# EAGLE design ADS1299_power (EAGLE 8.3.1)
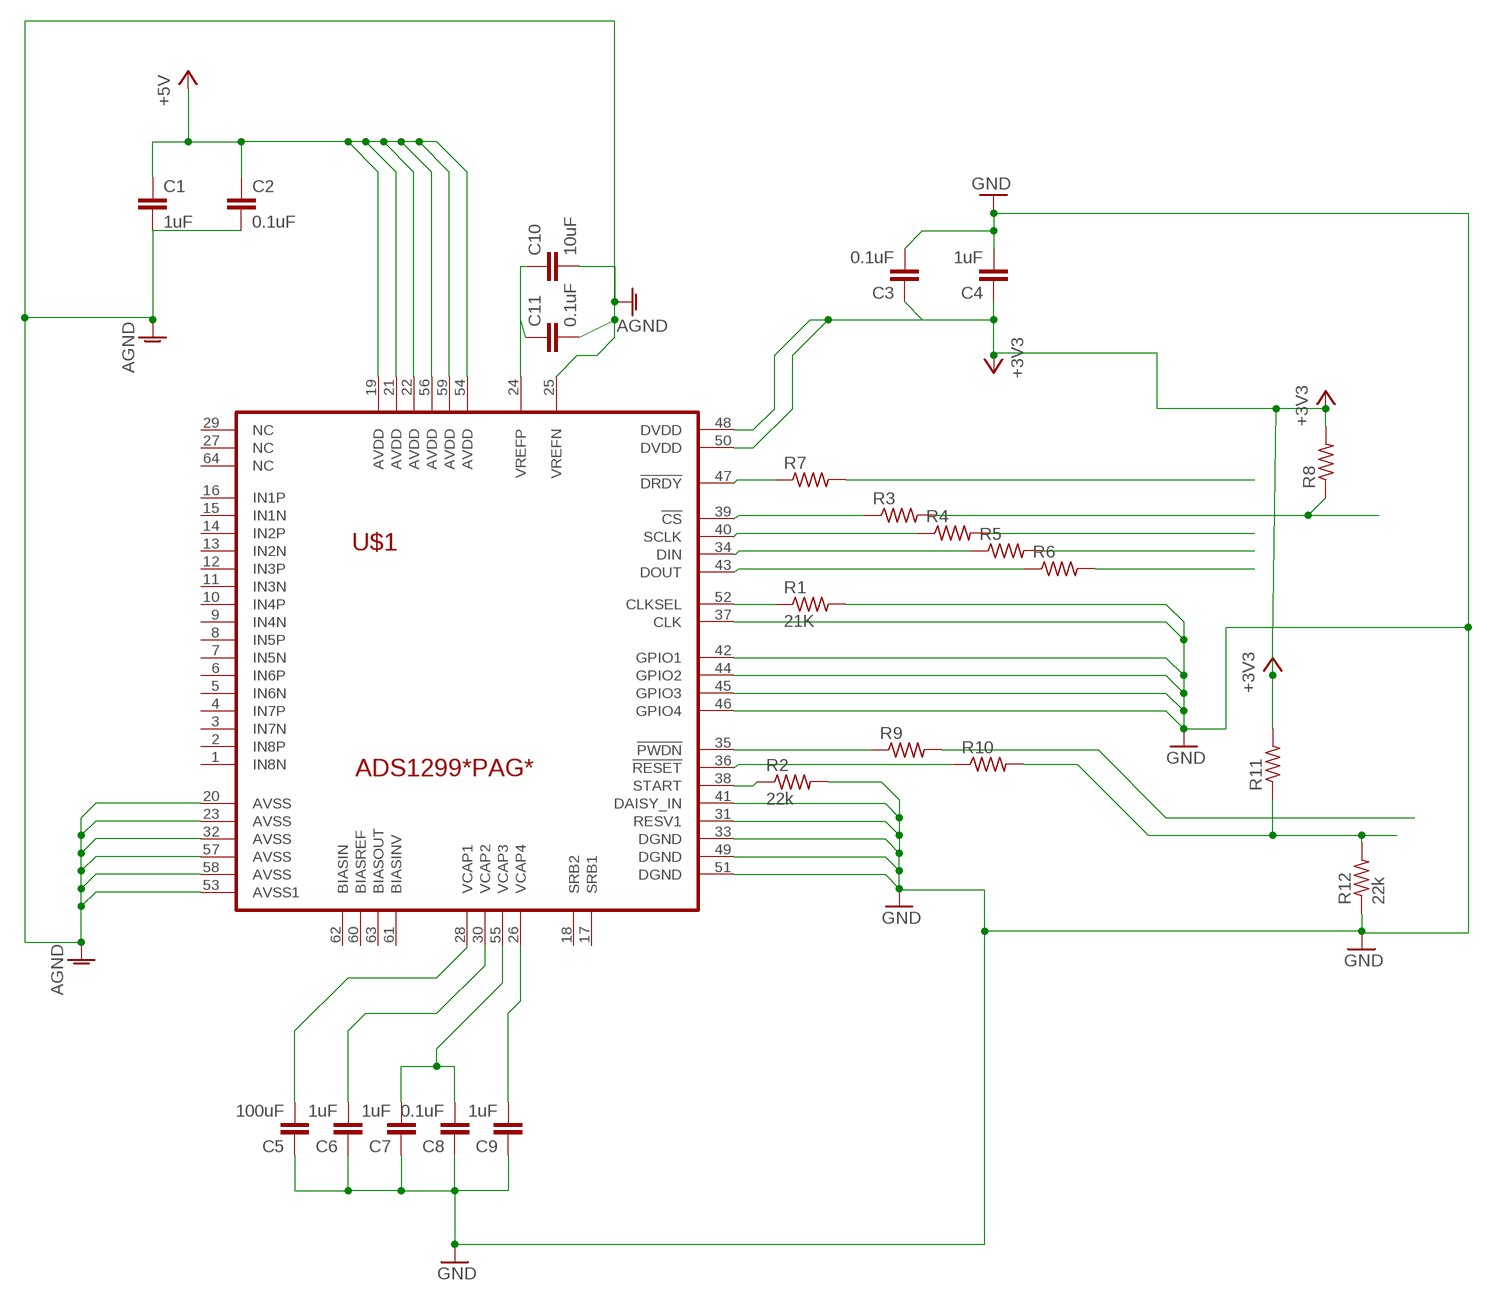
[diagram p0: schematic, sheet 1]

## Parts
C1  1uF  C2,5-3  [C2.5-3]
C2  0.1uF  C2,5-3  [C2.5-3]
C3  0.1uF  C2,5-3  [C2.5-3]
C4  1uF  C2,5-3  [C2.5-3]
C5  100uF  C2,5-3  [C2.5-3]
C6  1uF  C2,5-3  [C2.5-3]
C7  1uF  C2,5-3  [C2.5-3]
C8  0.1uF  C2,5-3  [C2.5-3]
C9  1uF  C2,5-3  [C2.5-3]
C10  10uF  C2,5-3  [C2.5-3]
C11  0.1uF  C2,5-3  [C2.5-3]
R1  21K  R-US_0204/2V  [0204V]
R2  22k  R-US_0204/2V  [0204V]
R3  R-US_0204/2V  [0204V]
R4  R-US_0204/2V  [0204V]
R5  R-US_0204/2V  [0204V]
R6  R-US_0204/2V  [0204V]
R7  R-US_0204/2V  [0204V]
R8  R-US_0204/2V  [0204V]
R9  R-US_0204/2V  [0204V]
R10  R-US_0204/2V  [0204V]
R11  R-US_0204/2V  [0204V]
R12  22k  R-US_0204/2V  [0204V]
U$1  ADS1299*PAG*  [TQFP64]

## Nets
+3V3: C3.1 C4.1 R8.2 R11.2 U$1.48(DVDD) U$1.50(DVDD)
+5V: C1.1 C2.1 U$1.19(AVDD) U$1.21(AVDD) U$1.22(AVDD) U$1.54(AVDD) U$1.56(AVDD) U$1.59(AVDD)
AGND: C1.2 C2.2 C10.2 C11.2 U$1.20(AVSS) U$1.23(AVSS) U$1.25(VREFN) U$1.32(AVSS) U$1.53(AVSS1) U$1.57(AVSS) U$1.58(AVSS)
GND: C3.2 C4.2 C5.1 C6.1 C7.1 C8.1 C9.1 R1.2 R2.2 R12.1 U$1.31(RESV1) U$1.33(DGND) U$1.37(CLK) U$1.41(DAISY_IN) U$1.42(GPIO1) U$1.44(GPIO2) U$1.45(GPIO3) U$1.46(GPIO4) U$1.49(DGND) U$1.51(DGND)
N$1: C9.2 U$1.26(VCAP4)
N$2: C7.2 C8.2 U$1.55(VCAP3)
N$3: C10.1 C11.1 U$1.24(VREFP)
N$4: R1.1 U$1.52(CLKSEL)
N$6: C5.2 U$1.28(VCAP1)
N$7: R3.1 U$1.39(!CS)
N$8: R4.1 U$1.40(SCLK)
N$9: C6.2 U$1.30(VCAP2)
N$10: R2.1 U$1.38(START)
N$11: R5.1 U$1.34(DIN)
N$12: R6.1 U$1.43(DOUT)
N$13: R3.2 R8.1
N$14: R4.2
N$15: R5.2
N$16: R6.2
N$17: R7.1 U$1.47(!DRDY)
N$18: R7.2
N$19: R10.1 U$1.36(!RESET)
N$20: R9.1 U$1.35(!PWDN)
N$21: R9.2
N$22: R10.2 R11.1 R12.2
Unconnected: U$1.1(IN8N) U$1.2(IN8P) U$1.3(IN7N) U$1.4(IN7P) U$1.5(IN6N) U$1.6(IN6P) U$1.7(IN5N) U$1.8(IN5P) U$1.9(IN4N) U$1.10(IN4P) U$1.11(IN3N) U$1.12(IN3P) U$1.13(IN2N) U$1.14(IN2P) U$1.15(IN1N) U$1.16(IN1P) U$1.17(SRB1) U$1.18(SRB2) U$1.27(NC) U$1.29(NC) U$1.60(BIASREF) U$1.61(BIASINV) U$1.62(BIASIN) U$1.63(BIASOUT) U$1.64(NC)

## Library data of the parts
C1-C11 = capacitor-wima:C: CAPACITOR naming: grid - package width
R1-R12 = resistor:R-US_: RESISTOR, American symbol
U$1 = ADS129x:ADS1299: 8-Channel, 24-Bit Analog-To-Digital Converter With Integrated EEG Front End. ADS1299 modifications by Adam Feuer (adam@adamfeuer.com) Based on ADS1298: Drawn 23.07.2011 by Tomasz Boleslaw CEDRO (http://www.tomek.cedro.info).

## Board
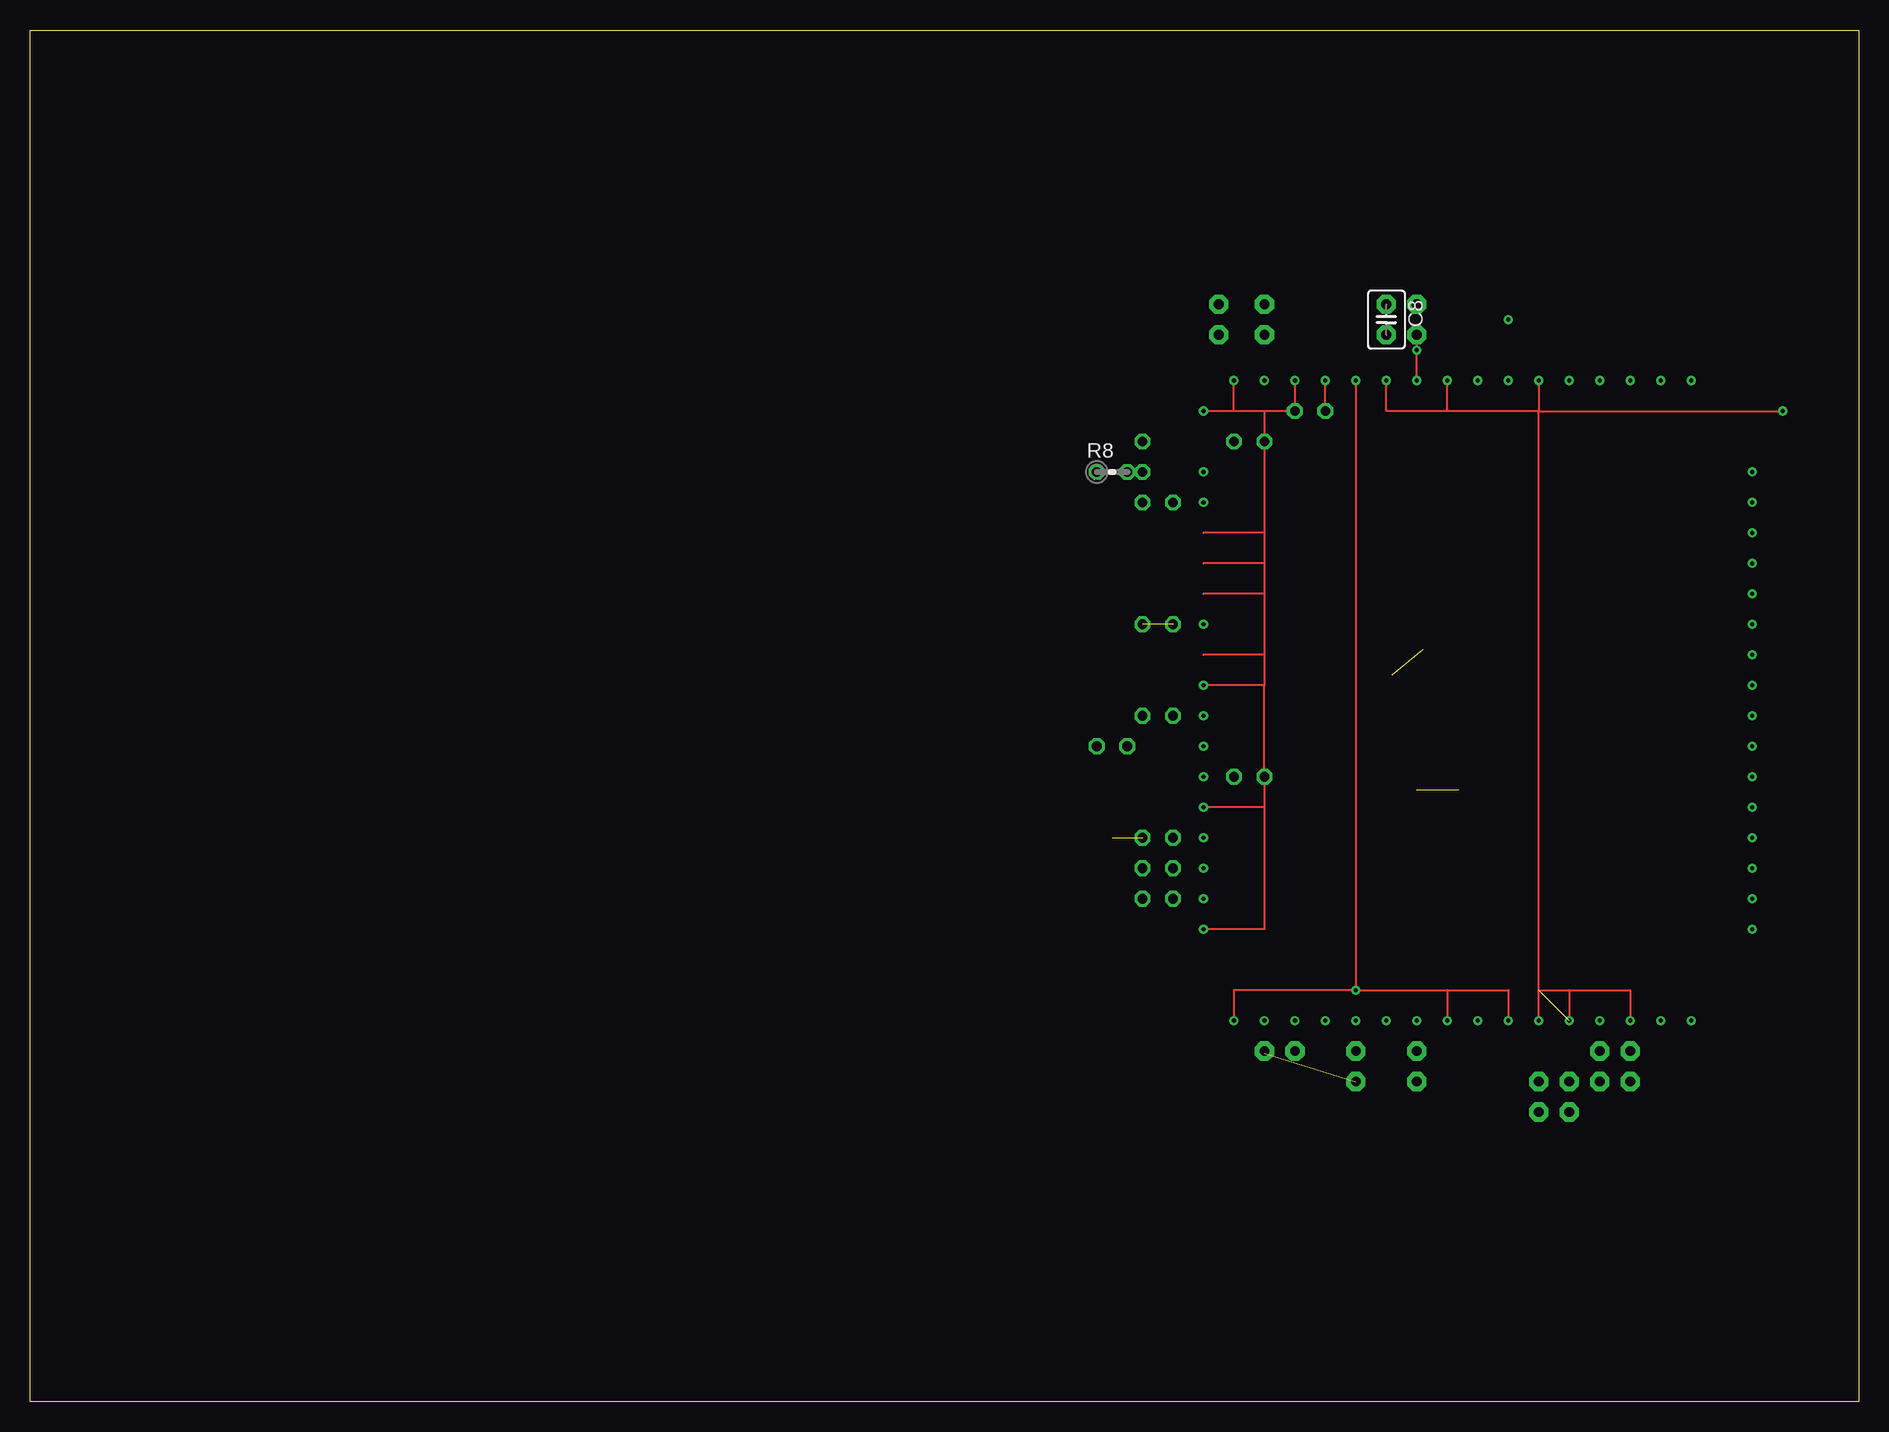
[diagram p1: board, top side]
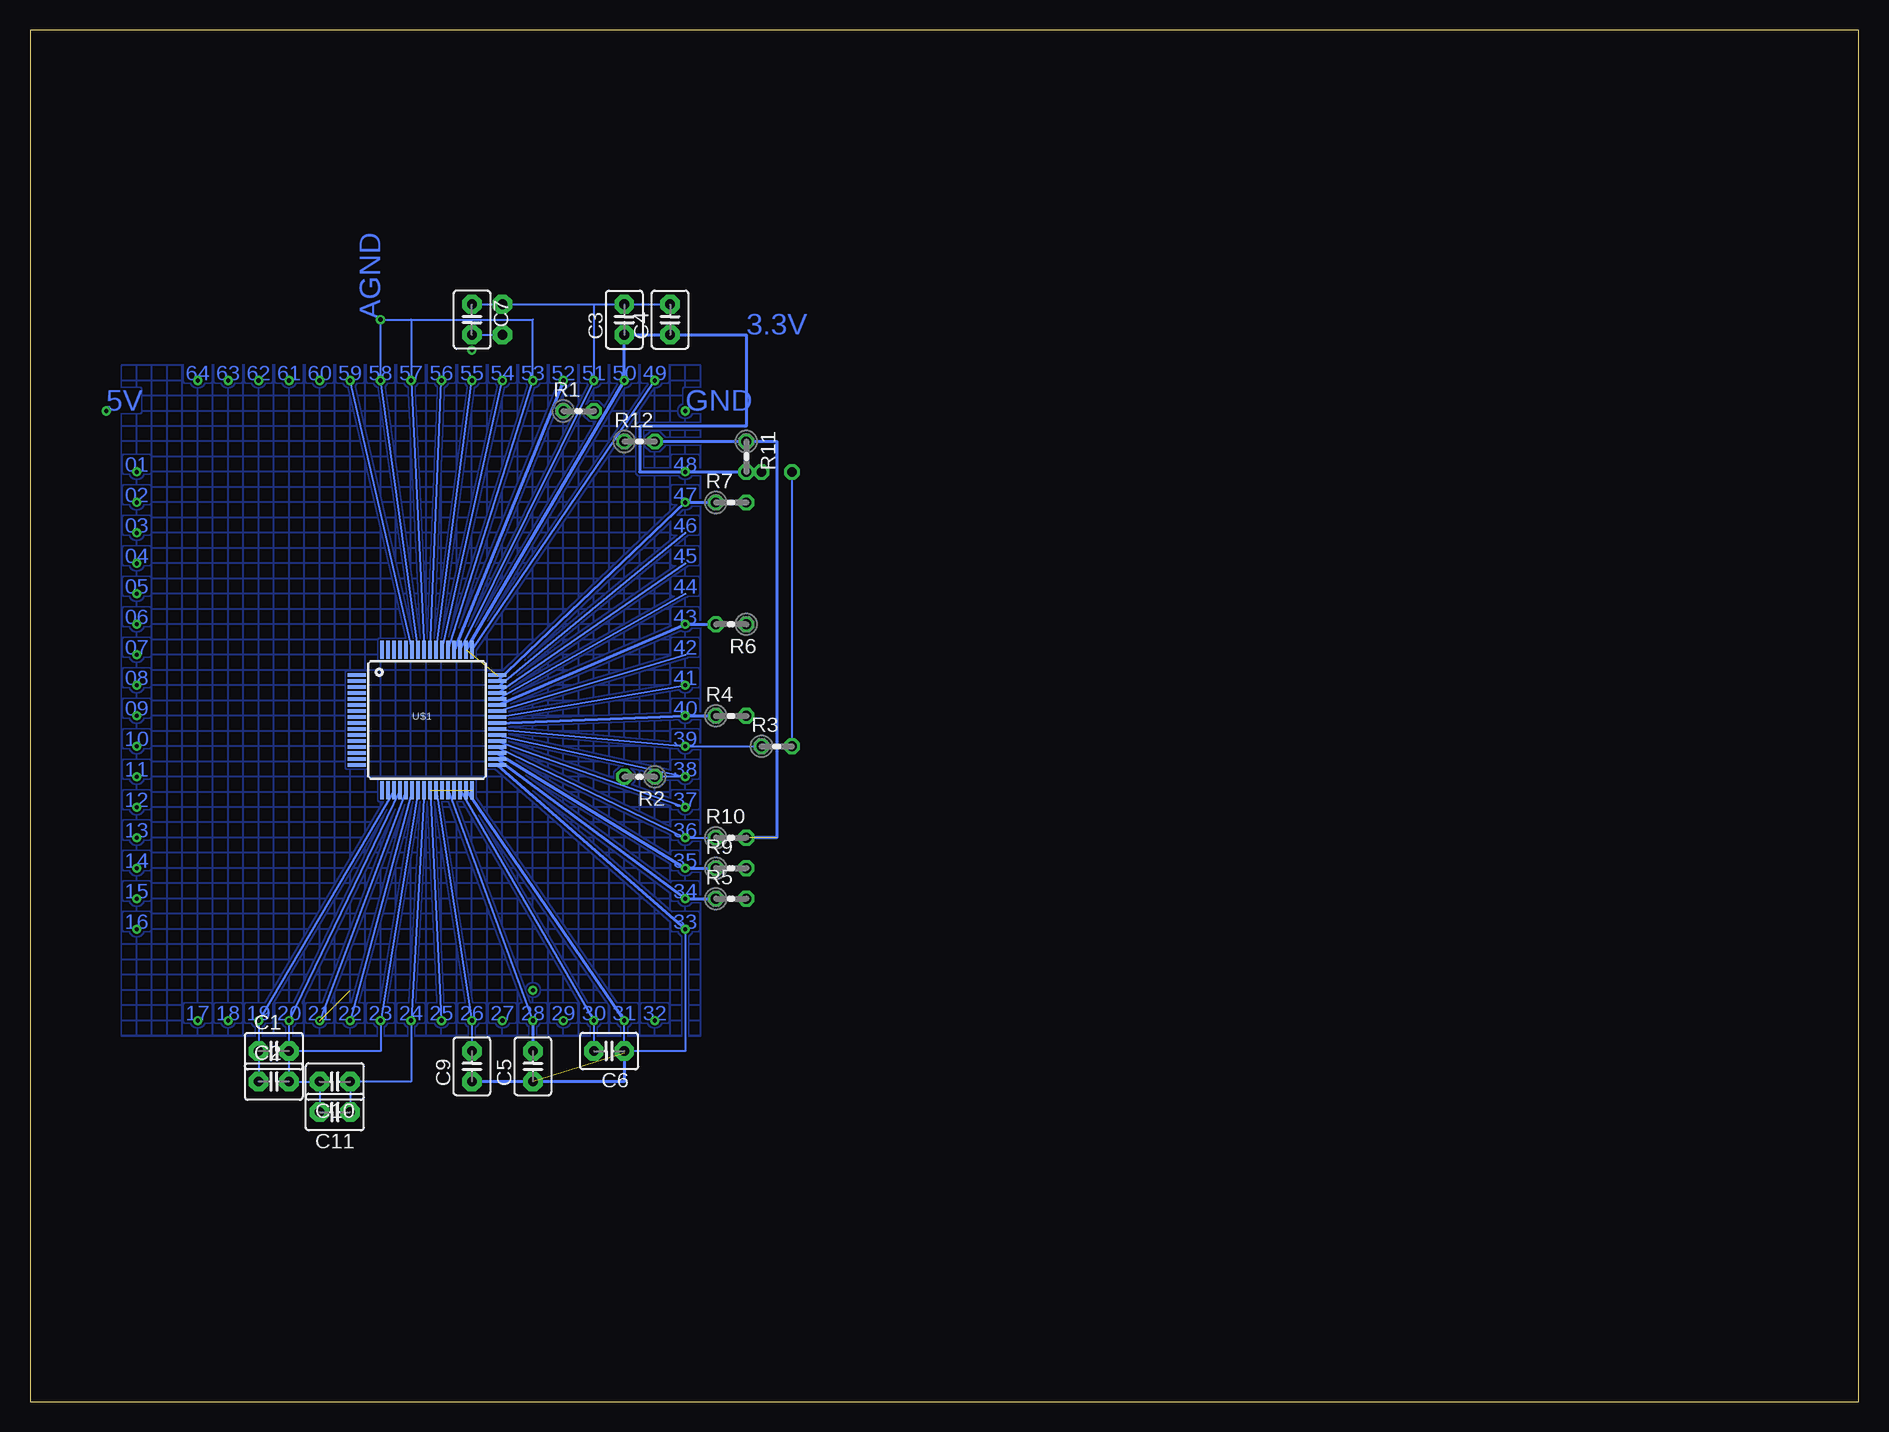
[diagram p2: board, bottom side, seen from below]

Size 152.4 x 114.3 mm. Coordinates in mm from the lower left corner, seen from the top.
Outline: 152.4,0 0,0 0,114.3 152.4,114.3 152.4,0
Copper layers (1*16): Top 0.035mm / dielectric 1.5mm / Bottom 0.035mm
Design rules "default": minimum track width 6mil, minimum drill 0.35mm, track to track 6mil, track to pad 6mil, pad to pad 6mil, via to via 6mil, smd to smd 6mil, copper to edge 40mil, drill to drill 6mil, minimum pad ring 10mil, minimum via ring 8mil, stop-mask expansion 4mil, vias tented up to drill 0mil, thermal gap 10mil

### Footprints (pad centres in the part's own frame; a part is rotated, then mirrored left to right if it is on the bottom)
C2.5-3 = drill 0.813 pad 1.6 octagon: 1 -1.27,0; 2 1.27,0
0204V = drill 0.813 octagon: 1 -1.27,0; 2 1.27,0
TQFP64 = smd 1.5 x 0.285: 1 -5.85,3.75; 2 -5.85,3.25; 3 -5.85,2.75; 4 -5.85,2.25; 5 -5.85,1.75; 6 -5.85,1.25; 7 -5.85,0.75; 8 -5.85,0.25; 9 -5.85,-0.25; 10 -5.85,-0.75; 11 -5.85,-1.25; 12 -5.85,-1.75; 13 -5.85,-2.25; 14 -5.85,-2.75; 15 -5.85,-3.25; 16 -5.85,-3.75; 33 5.85,-3.75; 34 5.85,-3.25; 35 5.85,-2.75; 36 5.85,-2.25; 37 5.85,-1.75; 38 5.85,-1.25; 39 5.85,-0.75; 40 5.85,-0.25; 41 5.85,0.25; 42 5.85,0.75; 43 5.85,1.25; 44 5.85,1.75; 45 5.85,2.25; 46 5.85,2.75; 47 5.85,3.25; 48 5.85,3.75 | smd 0.285 x 1.5: 17 -3.75,-5.85; 18 -3.25,-5.85; 19 -2.75,-5.85; 20 -2.25,-5.85; 21 -1.75,-5.85; 22 -1.25,-5.85; 23 -0.75,-5.85; 24 -0.25,-5.85; 25 0.25,-5.85; 26 0.75,-5.85; 27 1.25,-5.85; 28 1.75,-5.85; 29 2.25,-5.85; 30 2.75,-5.85; 31 3.25,-5.85; 32 3.75,-5.85; 49 3.75,5.85; 50 3.25,5.85; 51 2.75,5.85; 52 2.25,5.85; 53 1.75,5.85; 54 1.25,5.85; 55 0.75,5.85; 56 0.25,5.85; 57 -0.25,5.85; 58 -0.75,5.85; 59 -1.25,5.85; 60 -1.75,5.85; 61 -2.25,5.85; 62 -2.75,5.85; 63 -3.25,5.85; 64 -3.75,5.85

### Placement (x,y rotation side)
C1  132.08,29.21 0 bottom
C2  132.08,26.67 0 bottom
C3  102.87,90.17 90 bottom
C4  99.06,90.17 90 bottom
C5  110.49,27.94 90 bottom
C6  104.14,29.21 180 bottom
C7  115.57,90.17 270 bottom
C8  113.03,90.17 270 top
C9  115.57,27.94 90 bottom
C10  127,26.67 180 bottom
C11  127,24.13 180 bottom
R1  106.68,82.55 0 bottom
R2  101.6,52.07 180 bottom
R3  90.17,54.61 0 bottom
R4  93.98,57.15 0 bottom
R5  93.98,41.91 0 bottom
R6  93.98,64.77 180 bottom
R7  93.98,74.93 0 bottom
R8  90.17,77.47 0 top
R9  93.98,44.45 0 bottom
R10  93.98,46.99 0 bottom
R11  92.71,78.74 270 bottom
R12  101.6,80.01 0 bottom
U$1  119.31,56.8 0 bottom

### Tracks (layer width: path | path; a pad name or v marks a point on that pad's centre or on a via)
+3V3  (1 unrouted)
  Bottom 0.254: R8.2 R11.2 101.6,77.47 101.6,81.28 92.71,81.28 92.71,88.9 C4.1 C3.1 102.87,85.09 U$1.50
+5V  (via drill 0.35)  (5 unrouted)
  Top 0.152: 125.73,85.09 125.73,82.55 | 125.73,82.55 146.05,82.55 | 125.73,82.55 118.11,82.55 | 118.11,82.55 118.11,85.09 | 118.11,82.55 113.03,82.55 113.03,85.09 | 125.73,34.29 128.27,34.29 | 128.27,34.29 133.35,34.29 133.35,31.75 | v125.73,31.75 125.73,34.29 | 125.73,34.29 125.73,82.55 | 128.27,34.29 v128.27,31.75
  Bottom 0.152: U$1.59 125.73,85.09 | U$1.56 118.11,85.09 | U$1.54 113.03,85.09 | U$1.19 133.35,31.75 C1.1 C2.1 | U$1.21 v128.27,31.75 | U$1.22 v125.73,31.75
AGND  (via drill 0.35)  (1 unrouted)
  Top 0.152: 118.11,34.29 v118.11,31.75 | 118.11,34.29 123.19,34.29 v123.19,31.75 | v110.49,85.09 v110.49,34.29 | v110.49,34.29 118.11,34.29 | v110.49,34.29 100.33,34.29 100.33,31.75
  Bottom 0.152: U$1.53 v110.49,85.09 110.49,90.17 120.65,90.17 | 120.65,90.17 120.65,85.09 U$1.57 | U$1.58 123.19,85.09 123.19,90.17 120.65,90.17 | C1.2 C2.2 C10.2 C11.2 | U$1.25 v118.11,31.75 | U$1.23 v123.19,31.75 123.19,29.21 C1.2 | C1.2 v130.81,31.75 U$1.20
GND  (via drill 0.35)  (9 unrouted)
  Top 0.152: 105.41,85.09 R1.2 102.87,82.55 | 102.86,79.97 R12.1 | 102.86,79.97 102.87,72.39 | 102.87,72.39 97.79,72.39 | 102.87,72.39 102.87,69.85 | 102.87,69.85 97.79,69.85 | 102.87,69.85 102.87,67.31 | 102.87,67.31 97.79,67.31 | 102.87,67.31 102.87,62.23 | 102.87,62.23 97.79,62.23 | 102.87,62.23 102.87,59.69 | 102.87,59.69 97.79,59.69 | 102.87,59.69 R2.2 102.87,49.53 | 102.87,49.53 97.79,49.53 | 102.87,49.53 102.87,39.37 v97.79,39.37 | 102.87,82.55 102.86,79.97 | 102.87,82.55 100.33,82.55 | 100.33,82.55 100.33,85.09 | 100.33,82.55 97.79,82.55
  Bottom 0.152: U$1.51 105.41,85.09 105.41,91.44 | U$1.46 97.79,72.39 | U$1.45 97.79,69.85 | U$1.44 97.79,67.31 | U$1.42 97.79,62.23 | U$1.41 97.79,59.69 | U$1.37 97.79,49.53 | U$1.49 100.33,85.09 | C4.2 C3.2 105.41,91.44 | v102.87,31.75 C6.1 102.87,29.03 102.69,29.21 97.79,29.21 v97.79,39.37 | C7.1 C8.1 105.41,91.44
  Bottom 0.254: 113.96,53.05 U$1.33 v97.79,39.37 | v102.87,31.75 U$1.31 | C6.1 102.87,26.67 C5.1 C9.1
N$1
  Bottom 0.152: U$1.26 115.57,31.75 C9.2
N$2  (via drill 0.35)
  Top 0.152: v115.57,85.09 v115.57,87.63 C7.2
  Bottom 0.152: C7.2 C8.2 | U$1.55 v115.57,85.09
N$3
  Bottom 0.152: U$1.24 120.65,31.75 120.65,26.67 C10.1 C11.1
N$4  (1 unrouted)
  Top 0.152: R1.1 107.95,85.09
  Bottom 0.254: 108.1,84.71 U$1.52 | 108.1,84.71 107.95,85.09 | 107.95,84.71 108.1,84.71
N$5
  pour Bottom (hatched): 144.78,86.36 144.78,30.48 96.52,30.48 96.52,86.36
N$6
  Bottom 0.152: U$1.28 110.49,31.75
  Bottom 0.254: 110.49,31.75 C5.2
N$7
  Bottom 0.152: U$1.39 97.79,54.61 R3.1
N$8
  Bottom 0.254: U$1.40 97.79,57.15 R4.1
N$9
  Bottom 0.152: U$1.30 105.41,31.75 C6.2
N$10
  Bottom 0.152: U$1.38 97.79,52.07 R2.1
N$11
  Bottom 0.254: U$1.34 97.79,41.91 R5.1
N$12  (1 unrouted)
  Bottom 0.254: U$1.43 97.79,64.77 95.25,64.77
N$13
  Bottom 0.152: R3.2 R8.1
N$17
  Bottom 0.254: U$1.47 97.79,74.93 R7.1
N$19
  Bottom 0.152: U$1.36 97.79,46.99 R10.1
N$20
  Bottom 0.254: U$1.35 97.79,44.45 R9.1
N$22  (1 unrouted)
  Bottom 0.254: R12.2 R11.1 90.17,80.01 90.17,46.99 R10.2
N$23  (via drill 0.35)
  other vias: 143.51,39.37
N$24  (via drill 0.35)
  other vias: 143.51,41.91
N$25  (via drill 0.35)
  other vias: 143.51,44.45
N$26  (via drill 0.35)
  other vias: 143.51,46.99
N$27  (via drill 0.35)
  other vias: 143.51,49.53
N$28  (via drill 0.35)
  other vias: 143.51,52.07
N$29  (via drill 0.35)
  other vias: 143.51,54.61
N$30  (via drill 0.35)
  other vias: 143.51,57.15
N$31  (via drill 0.35)
  other vias: 143.51,59.69
N$32  (via drill 0.35)
  other vias: 143.51,62.23
N$33  (via drill 0.35)
  other vias: 143.51,64.77
N$34  (via drill 0.35)
  other vias: 143.51,67.31
N$35  (via drill 0.35)
  other vias: 143.51,69.85
N$36  (via drill 0.35)
  other vias: 143.51,72.39
N$37  (via drill 0.35)
  other vias: 143.51,74.93
N$38  (via drill 0.35)
  other vias: 143.51,77.47
N$39  (via drill 0.35)
  other vias: 138.43,31.75
N$40  (via drill 0.35)
  other vias: 135.89,31.75
N$41  (via drill 0.35)
  other vias: 133.35,31.75
N$43  (via drill 0.35)
  other vias: 128.27,31.75
N$44  (via drill 0.35)
  other vias: 125.73,31.75
N$46  (via drill 0.35)
  other vias: 120.65,31.75
N$47  (via drill 0.35)
  other vias: 118.11,31.75
N$48  (via drill 0.35)
  other vias: 115.57,31.75
N$49  (via drill 0.35)
  other vias: 113.03,31.75
N$50  (via drill 0.35)
  other vias: 110.49,31.75
N$51  (via drill 0.35)
  other vias: 107.95,31.75
N$52  (via drill 0.35)
  other vias: 100.33,31.75
N$53  (via drill 0.35)
  other vias: 105.41,31.75
N$56  (via drill 0.35)
  other vias: 97.79,41.91
N$57  (via drill 0.35)
  other vias: 97.79,44.45
N$58  (via drill 0.35)
  other vias: 97.79,46.99
N$59  (via drill 0.35)
  other vias: 97.79,49.53
N$60  (via drill 0.35)
  other vias: 97.79,52.07
N$61  (via drill 0.35)
  other vias: 97.79,54.61
N$62  (via drill 0.35)
  other vias: 97.79,57.15
N$63  (via drill 0.35)
  other vias: 97.79,59.69
N$65  (via drill 0.35)
  other vias: 97.79,64.77
N$69  (via drill 0.35)
  other vias: 97.79,74.93
N$70  (via drill 0.35)
  other vias: 97.79,77.47
N$72  (via drill 0.35)
  other vias: 102.87,85.09
N$73  (via drill 0.35)
  other vias: 105.41,85.09
N$74  (via drill 0.35)
  other vias: 107.95,85.09
N$76  (via drill 0.35)
  other vias: 113.03,85.09
N$78  (via drill 0.35)
  other vias: 118.11,85.09
N$79  (via drill 0.35)
  other vias: 120.65,85.09
N$80  (via drill 0.35)
  other vias: 123.19,85.09
N$81  (via drill 0.35)
  other vias: 125.73,85.09
N$82  (via drill 0.35)
  other vias: 128.27,85.09
N$83  (via drill 0.35)
  other vias: 130.81,85.09
N$84  (via drill 0.35)
  other vias: 133.35,85.09
N$85  (via drill 0.35)
  other vias: 135.89,85.09
N$86  (via drill 0.35)
  other vias: 138.43,85.09
N$87  (via drill 0.35)
  other vias: 100.33,85.09
N$88  (via drill 0.35)
  other vias: 97.79,82.55
N$89  (via drill 0.35)
  other vias: 123.19,90.17
N$90  (via drill 0.35)
  other vias: 146.05,82.55

### Text on the board
Bottom: AGND | 3.3V | 49 | 50 | 51 | 52 | 53 | 54 | 55 | 56 | 57 | 58 | 59 | 60 | 61 | 62 | 63 | 64 | GND | 5V | 48 | 01 | 47 | 02 | 46 | 03 | 45 | 04 | 44 | 05 | 43 | 06 | 42 | 07 | 41 | 08 | 40 | 09 | 39 | 10 | 38 | 11 | 37 | 12 | 36 | 13 | 35 | 14 | 34 | 15 | 33 | 16 | 32 | 31 | 30 | 29 | 28 | 27 | 26 | 25 | 24 | 23 | 22 | 21 | 20 | 19 | 18 | 17